# Altium schematic sheet 04 Open MCU.SchDoc
size A3
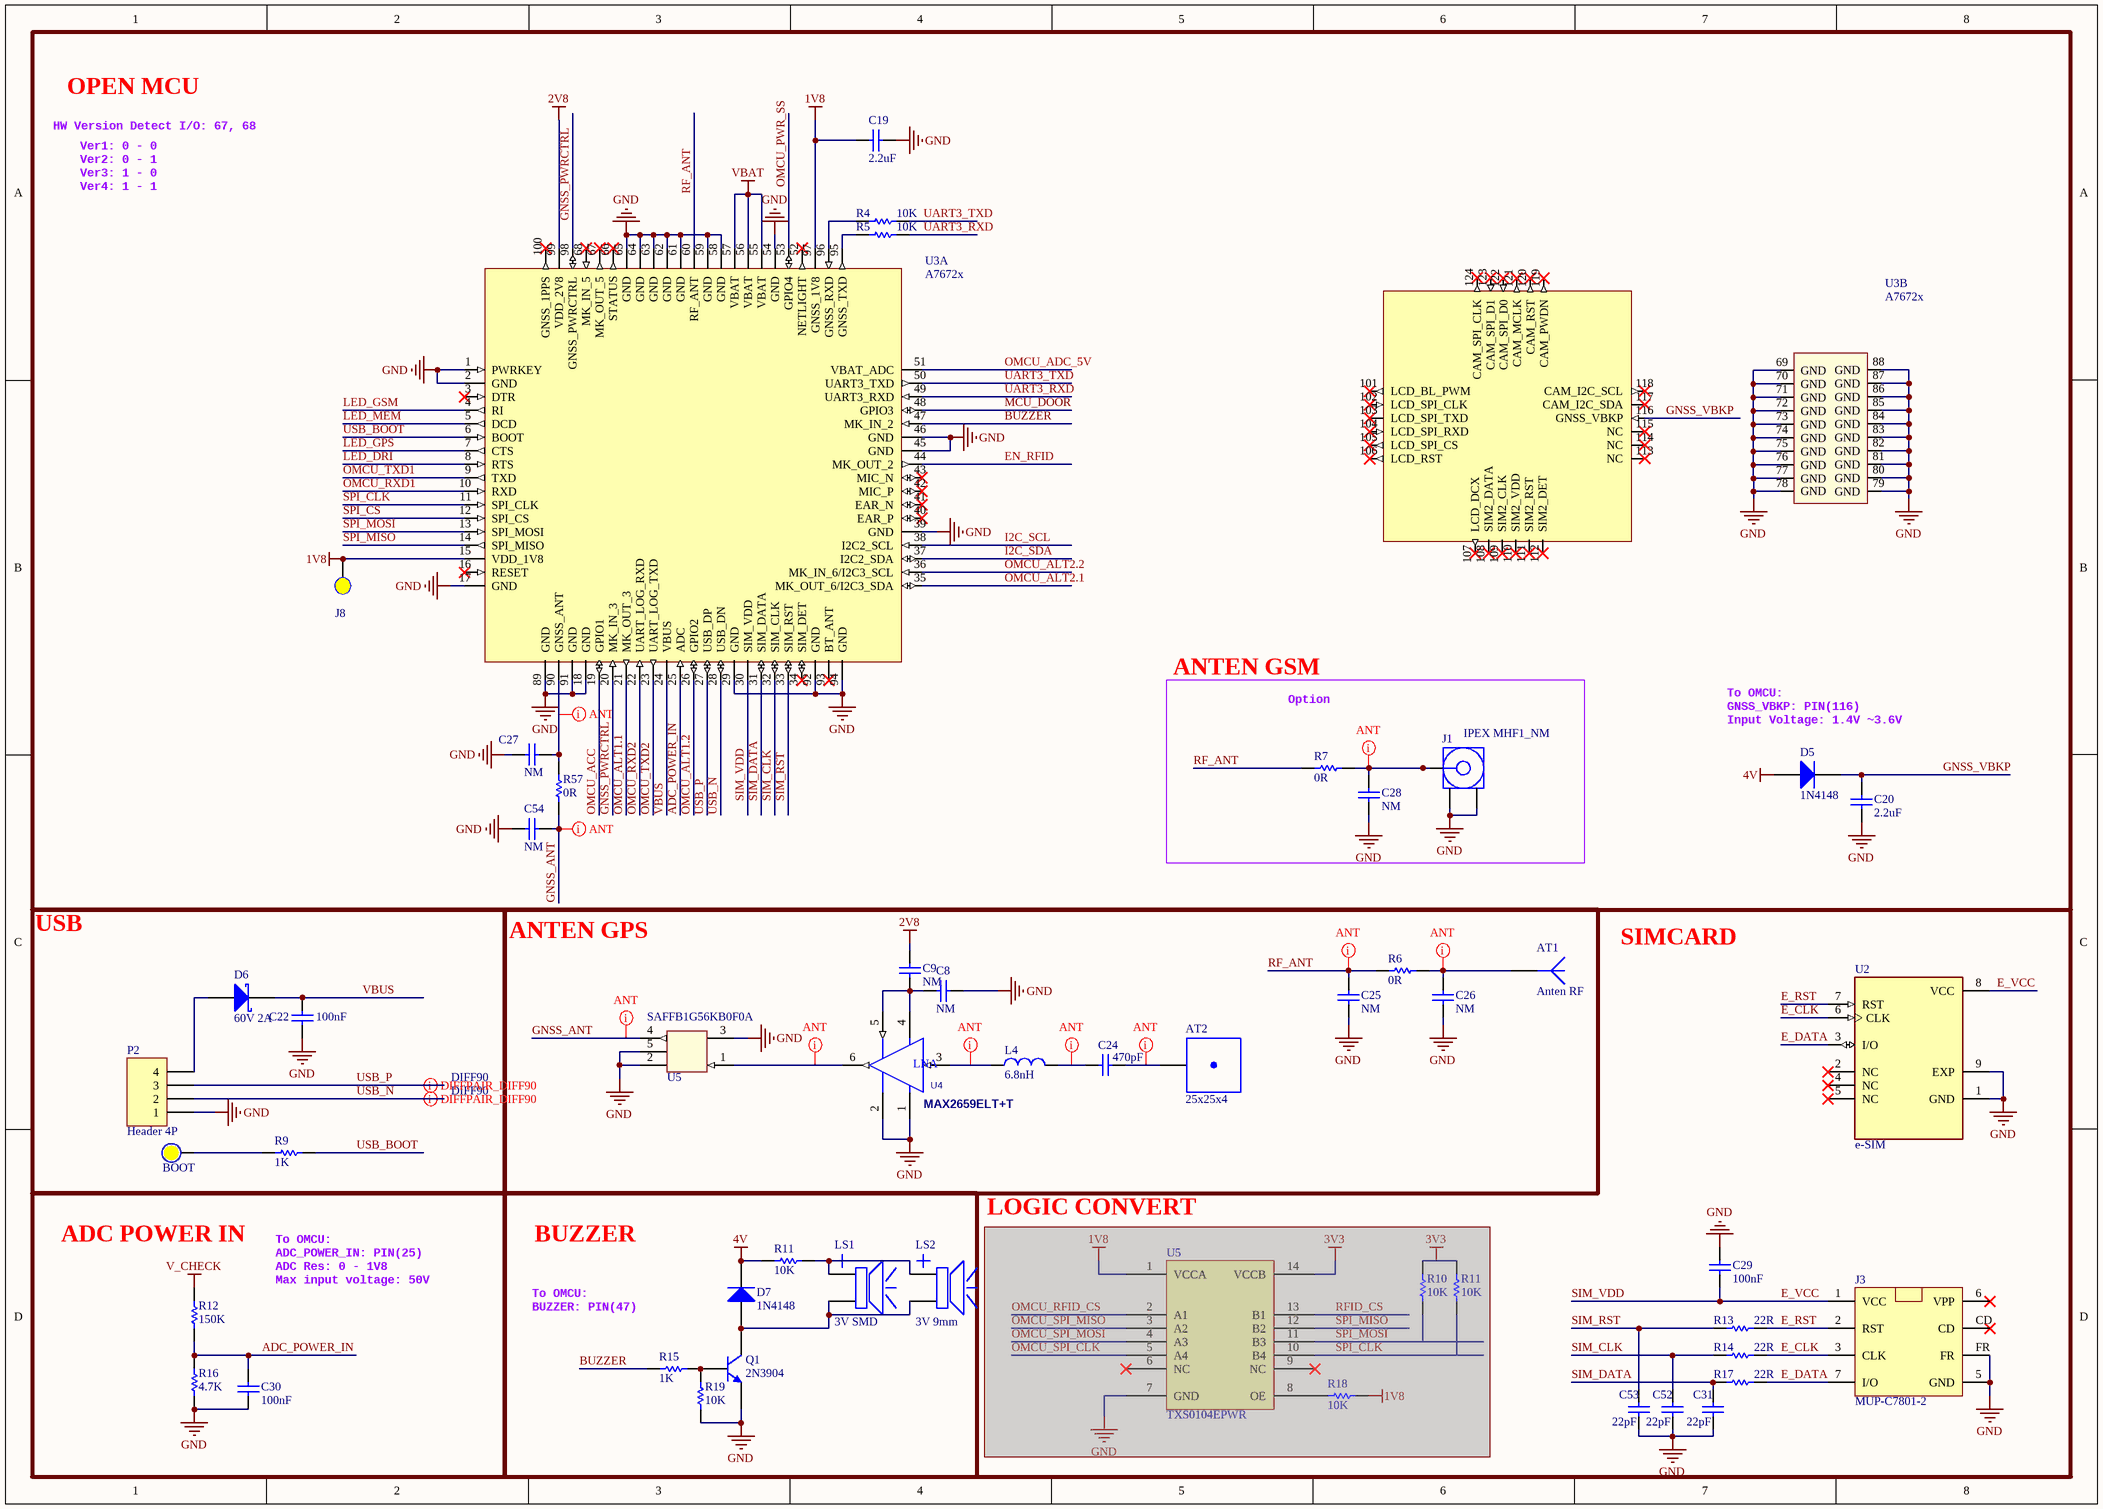
[diagram p0: 04 Open MCU.SchDoc]

## Parts
(Parts that share a designator on the sheet are numbered #1, #2 ... from top to bottom, then left to right.)
AT1  Anten RF  [ANT_GSM]
AT2  25x25x4  [Jinchang - 1575]
BOOT  (no value)  [Test Point 1 MM]  (no BOM)
C8  NM  [0402 - C]
C9  NM  [0402 - C]
C19  2.2uF  [0603 - C]
C20  2.2uF  [0603 - C]
C22  100nF  [0603 - C]
C24  470pF  [0402 - C]
C25  NM  [0402 - C]
C26  NM  [0402 - C]
C27  NM  [0402 - C]
C28  NM  [0402 - C]
C29  100nF  [0603 - C]
C30  100nF  [0603 - C]
C31  22pF  [0603 - C]
C52  22pF  [0603 - C]
C53  22pF  [0603 - C]
C54  NM  [0402 - C]
D5  1N4148  [SOD-123]
D6  60V 2A  [SOD-123]
D7  1N4148  [SOD-123]
J1  IPEX MHF1_NM  [IPEX]
J3  MUP-C7801-2  [MUP-C7801-2]
J8  1V8  [TP1]  (value not drawn)
L4  6.8nH  [0402 - L]
LS1  3V SMD  [Buzzer - SMD - 1]
LS2  3V 9mm  [Buzzer]
P2  Header 4P  [HDR1X4]
Q1  2N3904  [SOT23B]
R4  10K  [0603 - R]
R5  10K  [0603 - R]
R6  0R  [0402 - R]
R7  0R  [0402 - R]
R9  1K  [0603 - R]
R10  10K  [0603 - R]  (masked out: inside a compile mask, not in the netlist)
R11#1  10K  [0603 - R]
R11#2  10K  [0603 - R]  (masked out: inside a compile mask, not in the netlist)
R12  150K  [0603 - R]
R13  22R  [0603 - R]
R14  22R  [0603 - R]
R15  1K  [0603 - R]
R16  4.7K  [0603 - R]
R17  22R  [0603 - R]
R18  10K  [0603 - R]  (masked out: inside a compile mask, not in the netlist)
R19  10K  [0603 - R]
R57  0R  [0402 - R]
U2  e-SIM  [E-SIM 5*6mm]
U3  A7672x  [A7672]  (parts A,B of 2)
U4  MAX2659ELT+T  [SOT886]
U5#1  SAFFB1G56KB0F0A  [SAFFB1G56KB0F0A]
U5#2  TXS0104EPWR  [TSOP65P640X120-14N]  (masked out: inside a compile mask, not in the netlist)

## Blocks framed on the sheet
OPEN MCU: C19 C20 C27 C54 D5 J8 R4 R5 R57 U3
ANTEN GSM: C28 J1 R7
USB: BOOT C22 D6 P2 R9
ANTEN GPS: AT1 AT2 C8 C9 C24-C26 L4 R6 U4 U5#1
ADC POWER IN: C30 R12 R16
BUZZER: D7 LS1 LS2 Q1 R11#1 R15 R19

## Nets
1V8: C19.1 J8.1 U3.15(VDD_1V8) U3.97(GNSS_1V8)
2V8: C9.2 U3.99(VDD_2V8)
4V: D5.1(A) D7.2(K) R11#1.1
GND: C8.2 C19.2 C20.1 C22.1 C25.1 C26.1 C27.2 C28.1 C29.2 C30.1 C31.1 C52.1 C53.1 C54.2 J1.2 J3.5(GND) J3.FR P2.1 Q1.2(E) R16.1 R19.1 U2.1(GND) U2.9(EXP) U3.1(PWRKEY) U3.2(GND) U3.17(GND) U3.18(GND) U3.29(GND) U3.39(GND) U3.45(GND) U3.46(GND) U3.54(GND) U3.58(GND) U3.59(GND) U3.61(GND) U3.62(GND) U3.63(GND) U3.64(GND) U3.65(GND) U3.69(GND) U3.70(GND) U3.71(GND) U3.72(GND) U3.73(GND) U3.74(GND) U3.75(GND) U3.76(GND) U3.77(GND) U3.78(GND) U3.79(GND) U3.80(GND) U3.81(GND) U3.82(GND) U3.83(GND) U3.84(GND) U3.85(GND) U3.86(GND) U3.87(GND) U3.88(GND) U3.89(GND) U3.91(GND) U3.92(GND) U3.94(GND) U4.1(GND) U4.2(GND) U5#1.2(RST) U5#1.3(IO2) U5#1.5(VDD)
V_CHECK: R12.2
VBAT: U3.55(VBAT) U3.56(VBAT) U3.57(VBAT)
ADC_POWER_IN: C30.2 R12.1 R16.2 U3.25(ADC)
BUZZER: R15.1 U3.47(MK_IN_2)
E_CLK: J3.3(CLK) R14.2 U2.6(CLK)
E_DATA: J3.7(I/O) R17.2 U2.3(I/O)
E_RST: J3.2(RST) R13.2 U2.7(RST)
E_VCC: C29.1 J3.1(VCC) U2.8(VCC) U3.30(SIM_VDD)  [also labelled SIM_VDD]
EN_RFID: U3.44(MK_OUT_2)
GNSS_ANT: C54.1 R57.1 U5#1.4
GNSS_PWRCTRL: U3.20(MK_IN_3) U3.98(GNSS_PWRCTRL)
GNSS_VBKP: C20.2 D5.2(K) U3.116(GNSS_VBKP)
I2C_SCL: U3.38(I2C2_SCL)
I2C_SDA: U3.37(I2C2_SDA)
LED_DRI: U3.8(RTS)
LED_GPS: U3.7(CTS)
LED_GSM: U3.4(RI)
LED_MEM: U3.5(DCD)
MCU_DOOR: U3.48(GPIO3)
OMCU_ACC: U3.19(GPIO1)
OMCU_ADC_5V: U3.51(VBAT_ADC)
OMCU_ALT1.1: U3.21(MK_OUT_3)
OMCU_ALT1.2: U3.26(GPIO2)
OMCU_ALT2.1: U3.35(MK_OUT_6/I2C3_SDA)
OMCU_ALT2.2: U3.36(MK_IN_6/I2C3_SCL)
OMCU_PWR_SS: U3.53(GPIO4)
OMCU_RXD1: U3.10(RXD)
OMCU_RXD2: U3.22(UART_LOG_RXD)
OMCU_TXD1: U3.9(TXD)
OMCU_TXD2: U3.23(UART_LOG_TXD)
RF_ANT: C25.2 R6.1 R7.1 U3.60(RF_ANT)
SIM_CLK: C52.2 R14.1 U3.32(SIM_CLK)
SIM_DATA: C31.2 R17.1 U3.31(SIM_DATA)
SIM_RST: C53.2 R13.1 U3.33(SIM_RST)
SPI_CLK: U3.11(SPI_CLK)
SPI_CS: U3.12(SPI_CS)
SPI_MISO: U3.14(SPI_MISO)
SPI_MOSI: U3.13(SPI_MOSI)
UART3_RXD: R5.2 U3.49(UART3_RXD)
UART3_TXD: R4.2 U3.50(UART3_TXD)
USB_BOOT: R9.2 U3.6(BOOT)
USB_N: P2.2 U3.28(USB_DN)
USB_P: P2.3 U3.27(USB_DP)
VBUS: C22.2 D6.2(K) U3.24(VBUS)
NetAT1_1: AT1.1(A) C26.2 R6.2
NetAT2_1: AT2.1(ANT) C24.2
NetBOOT_0: BOOT.0 R9.1
NetC8_1: C8.1 C9.1 U4.4(VCC) U4.5(EN)
NetC24_1: C24.1 L4.2
NetC27_1: C27.1 R57.2 U3.90(GNSS_ANT)
NetC28_2: C28.2 J1.1(A) R7.2
NetD6_1: D6.1(A) P2.4
NetD7_1: D7.1(A) LS1.2 LS2.2 Q1.3(C)
NetL4_1: L4.1 U4.3(RF_IN)
NetLS1_1: LS1.1 LS2.1 R11#1.2
NetQ1_1: Q1.1(B) R15.2 R19.2
NetR4_1: R4.1 U3.96(GNSS_RXD)
NetR5_1: R5.1 U3.95(GNSS_TXD)
NetU4_6: U4.6(RF_OUT) U5#1.1(RX)

Not connected (* = marked no-connect by the designer): J3 6(VPP)* CD*; U2 2(NC)* 4(NC)* 5(NC)*; U3 3(DTR)* 16(RESET)* 34(SIM_DET)* 40(EAR_P)* 41(EAR_N)* 42(MIC_P)* 43(MIC_N)* 52(NETLIGHT)* 66(STATUS)* 67(MK_OUT_5)* 68(MK_IN_5)* 93(BT_ANT)* 100(GNSS_1PPS)* 101(LCD_BL_PWM)* 102(LCD_SPI_CLK)* 103(LCD_SPI_TXD)* 104(LCD_SPI_RXD)* 105(LCD_SPI_CS)* 106(LCD_RST)* 107(LCD_DCX)* 108(SIM2_DATA)* 109(SIM2_CLK)* 110(SIM2_VDD)* 111(SIM2_RST)* 112(SIM2_DET)* 113(NC)* 114(NC)* 115(NC)* 117(CAM_I2C_SDA)* 118(CAM_I2C_SCL)* 119(CAM_PWDN)* 120(CAM_RST)* 121(CAM_MCLK)* 122(CAM_SPI_D0)* 123(CAM_SPI_D1)* 124(CAM_SPI_CLK)*

## Layout directives
differential pair; differential pair class DIFF90: USB_N, USB_P
net class RF: GNSS_ANT, NetAT1_1, NetAT2_1, NetC24_1, NetC27_1, NetC28_2, NetL4_1, NetU4_6, RF_ANT

## Notes on the sheet
- HW Version Detect I/O: 67, 68
- Ver1: 0 - 0
- Ver2: 0 - 1
- Ver3: 1 - 0
- Ver4: 1 - 1
- Option
- GNSS_VBKP: PIN(116)
- Input Voltage: 1.4V ~3.6V
- To OMCU:
- SIMCARD
- ADC_POWER_IN: PIN(25)
- LOGIC CONVERT
- ADC Res: 0 - 1V8
- Max input voltage: 50V
- BUZZER: PIN(47)
- (in symbol MAX2659) LNA

## Library data of the parts
AT1 = ANT_GSM_PCB: Antenna GSM PCB; Brand: VNET; Part Number: PCB
AT2 = ANT-GPS 25x25: 25x25x4mm thick GPS Patch Antenna; MPN: JTDT1575-1602S; MFR: Jinchang & Amotech; Company ID: VT_ANT_GPS 1596; MPN2: A25-4102820-AMT23
BOOT = Test Point: Solder: NF
C8 C9 C25-C28 C54 = Cap 0402 NM: CAP CER NM X5R 0402; MFR: Yageo; Company ID: VT_TỤ ĐIỆN_C0402 NM; Voltage: 6.3V; MPN: NM; Size: C0402: NM; Package: 0402; Value: NM
C19 C20 = Cap 0603 2.2uF: CAP CER 2.2UF 50V X5R 0603; MFR: Murata Electronics; MPN: GRM188R61H225KE11J; Company ID: VT_CAP_C0603 2.2uF; Size: C0603: 2.2uF; Value: 2.2uF
C22 = Cap 0603 100nF: CAP CER 100nF 50V C0G/NP0 0603; MPN: CL10C104JB8NNNC; MFR: SAMSUNG; Company ID: VT_CAP_C0603 100nF; Voltage: 50V; Package: 0603; Size: C0603: 100nF; Value: 100nF
C24 = Cap 0402 470pF: CAP CER 470PF 50V X7R 0402; MPN: CL05B471JB5NNNC; MFR: Samsung; Company ID: VT_TỤ ĐIỆN_C0402 470pF; Voltage: 50V; Size: C0402: 820pF; Package: 0402; Value: 470pF
C29 C30 = Cap 0603 100nF: CAP CER 100nF 50V C0G/NP0 0603; MPN: CL10C104JB8NNNC; MFR: SAMSUNG; Company ID: VT_TỤ ĐIỆN_C0603 100nF; Voltage: 50V; Package: 0603; Value: 100nF; Size: C0603: 100nF
C31 C52 C53 = Cap 0603 22pF: CAP CER 22PF 50V C0G/NP0 0603; MPN: CL10C220JB8NNNC; MFR: SAMSUNG; Company ID: VT_TỤ ĐIỆN_C0603 22pF; Value: 22pF; Size: C0603: 22pF
D5 D7 = Diode 1N4148: DIODE GEN PURP 100V 300MA SOD123; MPN: 1N4148W-7-F; MFR: DIODES; Company ID: VT_DIODE_1N4148W-7-F
D6 = Diode PMEG6020ER: DIODE SCHOTTKY 60V 2A SOD123W; MPN: PMEG6020ER,115; MFR: NXP; Company ID: VT_DIODE_PMEG6020ER
J1 = IPEX: CONN UMC RCPT STR 50 OHM SMD; MPN: RECE.20279.001E.01; MFR: Taoglas; Company ID: VT_CONN_IPEX; MPN2: MUP-R4151
J3 = Socket Nano SIM MUP-C7801-2: Socket Nano Sim 7pin (6+1); MFR: MUP; Company ID: VT_CONN_SIM MUP-C7801-2; MPN: MUP-C7801-2
J8 = TP: 1mm - 1 layer
L4 = Inductor 0402 6.8nH: FIXED IND 6.8NH 430MA 250 MOHM; MPN: HK10056N8J-T; MFR: Taiyo Yuden; Company ID: VT_IND_0402 6.8nH; Size: L0402: 6.8nH; Value: 6.8nH
LS1 = Speaker SMD: AUDIO MAGNETIC IND 2-5V SMD; MFR: China; MPN: CMI-9653S-SMT; COmpany ID: VT_Buzzer 3V 9mm SMD
LS2 = Speaker: Buzzer 9*6mm (D*h); MFR: China; MPN: TMB09A03; Company ID: VT_Buzzer 3V 9mm
P2 = Header 4x1: Header, 4 Pin Pitch 2.54mm; MPN: S1012EC-40-ND; CompanyID: VT-00125; Solder: WAVE; Value: Header 4P
Q1 = Transistor 2N3904: TRANS NPN 40V 0.2A SOT-23; MPN: MMBT3904; MFR: Fairchild; Company ID: VT_TRANSISTOR_3904
R4 R5 R10 R11#1 R11#2 R18 = Res 0603 10K: RES SMD 10K OHM 1% 1/10W 0603; MFR: Yageo; MPN: RC0603FR-0710KL; Company ID: VT_RES_R0603 10K; Size: R0603: 10K; Value: 10K
R6 R7 R57 = Res 0402 0R: RES SMD 0 OHM JUMPER 1/16W 0402; MFR: Yageo; MPN: RC0402FR-070RL; Company ID: VT_ĐIỆN TRỞ_R0402 0R; Size: R0402: 0R; Package: 0402; Value: 0R
R9 R15 = Res 0603 1K: RES SMD 1K OHM 1% 1/10W 0603; MFR: Yageo; MPN: RC0603FR-071KL; Company ID: VT_RES_R0603 1K; Size: R0603: 1K; Value: 1K
R12 = Res 0603 150K: RES SMD 150K OHM 1% 1/10W 0603; MFR: YAGEO; MPN: RE0603FRE07150KL; Company ID: VT_RES_R0603 150K; Size: R0603: 150K; Value: 150K
R13 R14 R17 = Res 0603 22R: RES SMD 22 OHM 1% 1/10W 0603; MFR: Yageo; MPN: RC0603FR-0722RL; Company ID: VT_ĐIỆN TRỞ_R0603 22R; Value: 22R; Size: R0603: 22R
R16 = Res 0603 4.7K: RES SMD 4.7K OHM 1% 1/10W 0603; MFR: Yageo; MPN: RC0603FR-074K7L; Company ID: VT_RES_R0603 4.7K; Size: R0603: 4.7K; Value: 4.7K
R19 = Res 0603 10K: RES SMD 10K OHM 1% 1/10W 0603; MFR: Yageo; MPN: RC0603FR-0710KL; Company ID: VT_ĐIỆN TRỞ_R0603 10K; Value: 10K; Size: R0603: 10K
U2 = SIM-E-MFF2-GL-250: SIM Cards eUICC MFF2 Global SIM; MFR: HoloGram; Solder: SMT; MPN: SIM-E-MFF2-GL-250; Value: e-SIM; Category: IC; PinCount: 8
U3 = A7672x: LTE CAT 1 module, 2,3,4G; MFR: SIMCOM; MPN: A7672S; Company ID: VT_Module_A7672S
U4 = MAX2659: IC RF AMP GPS 1575.42MHZ 6UDFN; MFR: Maxim Integrated; Company ID: VT_IC_MAX2659; MPN: MAX2659ELT+T
U5#1 = SAFFB1G56KB0F0A: SAW Filter RF 1561.1MHz /1575.42MHz/1602MHz 1.9dB 50Ohm SMD 5 Pin Ammo; MFR: Murata; Category: MODULE; MPN: SAFFB1G56KB0F0A; PinCount: 5; Value: SAFFB1G56KB0F0A
U5#2 = TXS0104EPWR: IC 4BIT NON-INV TRANSLTR 14TSSOP; Solder: SMT; Value: TXS0104EPWR; MPN: TXS0104EPWR; Category: IC